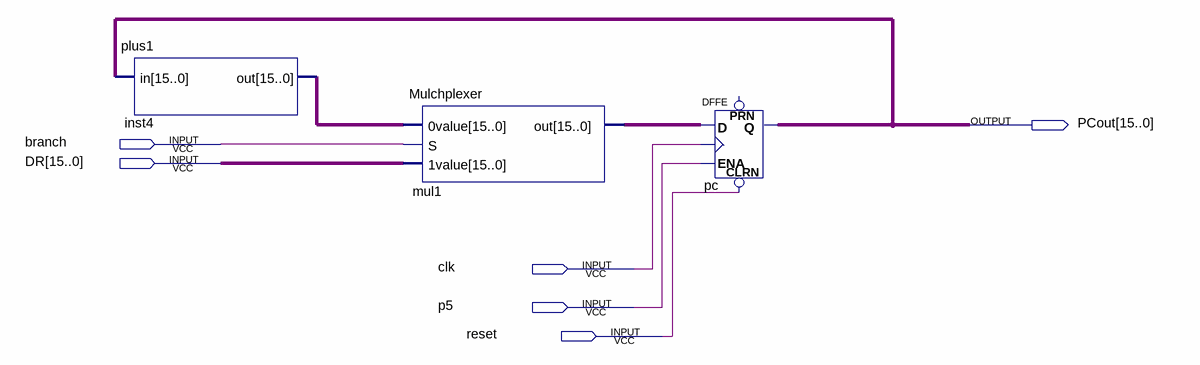
[diagram p0: schematic sheet]
// Quartus schematic pc2withcount.bdf as structural Verilog: 3 symbols, 6 pins
module pc2withcount (
  input  branch,
  input  [15:0] DR,
  input  clk,
  input  p5,
  input  reset,
  output [15:0] PCout
);

  wire [15:0] inst4_out, mul1_out;

  plus1 inst4 (.in(PCout), .out(inst4_out));
  Mulchplexer mul1 (.\0value (inst4_out), .S(branch), .\1value (DR), .out(mul1_out));
  DFFE pc[15:0] (.CLRN(reset), .D(mul1_out), .CLK(clk), .ENA(p5), .Q(PCout));  // open: PRN
endmodule
